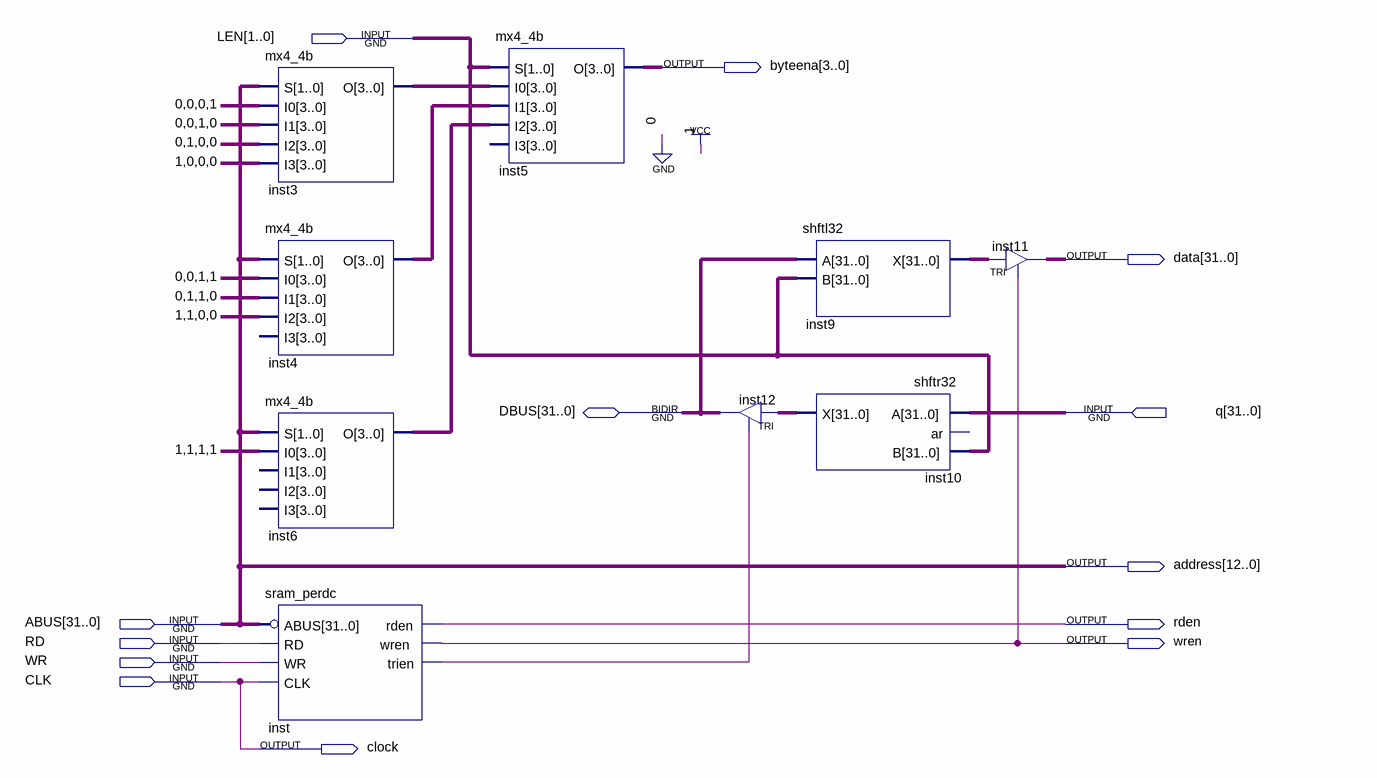
[diagram p0: schematic sheet]
// Quartus schematic sramif.bdf as structural Verilog: 9 symbols, 13 pins
module sramif (
  input  [1:0] LEN,
  input  [31:0] q,
  input  [31:0] ABUS,
  input  RD,
  input  WR,
  input  CLK,
  inout  [31:0] DBUS,
  output [3:0] byteena,
  output [31:0] data,
  output [12:0] address,
  output rden,
  output wren,
  output clock
);

  wire inst_trien;
  wire [3:0] inst3_o, inst4_o, inst6_o;
  wire [31:0] inst9_x, inst10_x;

  mx4_4b inst3 (.S(ABUS[1:0]), .I0(4'b0001), .I1(4'b0010), .I2(4'b0100), .I3(4'b1000), .O(inst3_o));
  mx4_4b inst4 (.S(ABUS[1:0]), .I0(4'b0011), .I1(4'b0110), .I2(4'b1100), .O(inst4_o));  // open: I3
  mx4_4b inst6 (.S(ABUS[1:0]), .I0(4'b1111), .O(inst6_o));  // open: I1, I2, I3
  sram_perdc inst (
    .ABUS(ABUS ^ 32'hffff0000), .CLK(CLK), .RD(RD), .WR(WR), .rden(rden), .trien(inst_trien), .wren(wren));
  mx4_4b inst5 (.S(LEN), .I0(inst3_o), .I1(inst4_o), .I2(inst6_o), .O(byteena));  // open: I3
  TRI inst12[31:0] (.IN(inst10_x), .OE(inst_trien), .OUT(DBUS));
  shftl32 inst9 (.A(DBUS), .B({{27{1'b0}}, LEN, 3'b000}), .X(inst9_x));
  shftr32 inst10 (.A(q), .B({{27{1'b0}}, LEN, 3'b000}), .X(inst10_x));  // open: ar
  TRI inst11[31:0] (.IN(inst9_x), .OE(wren), .OUT(data));

  assign address = ABUS[14:2];
  assign clock = CLK;
endmodule
